# Altium schematic sheet MGC3130.SchDoc
size A
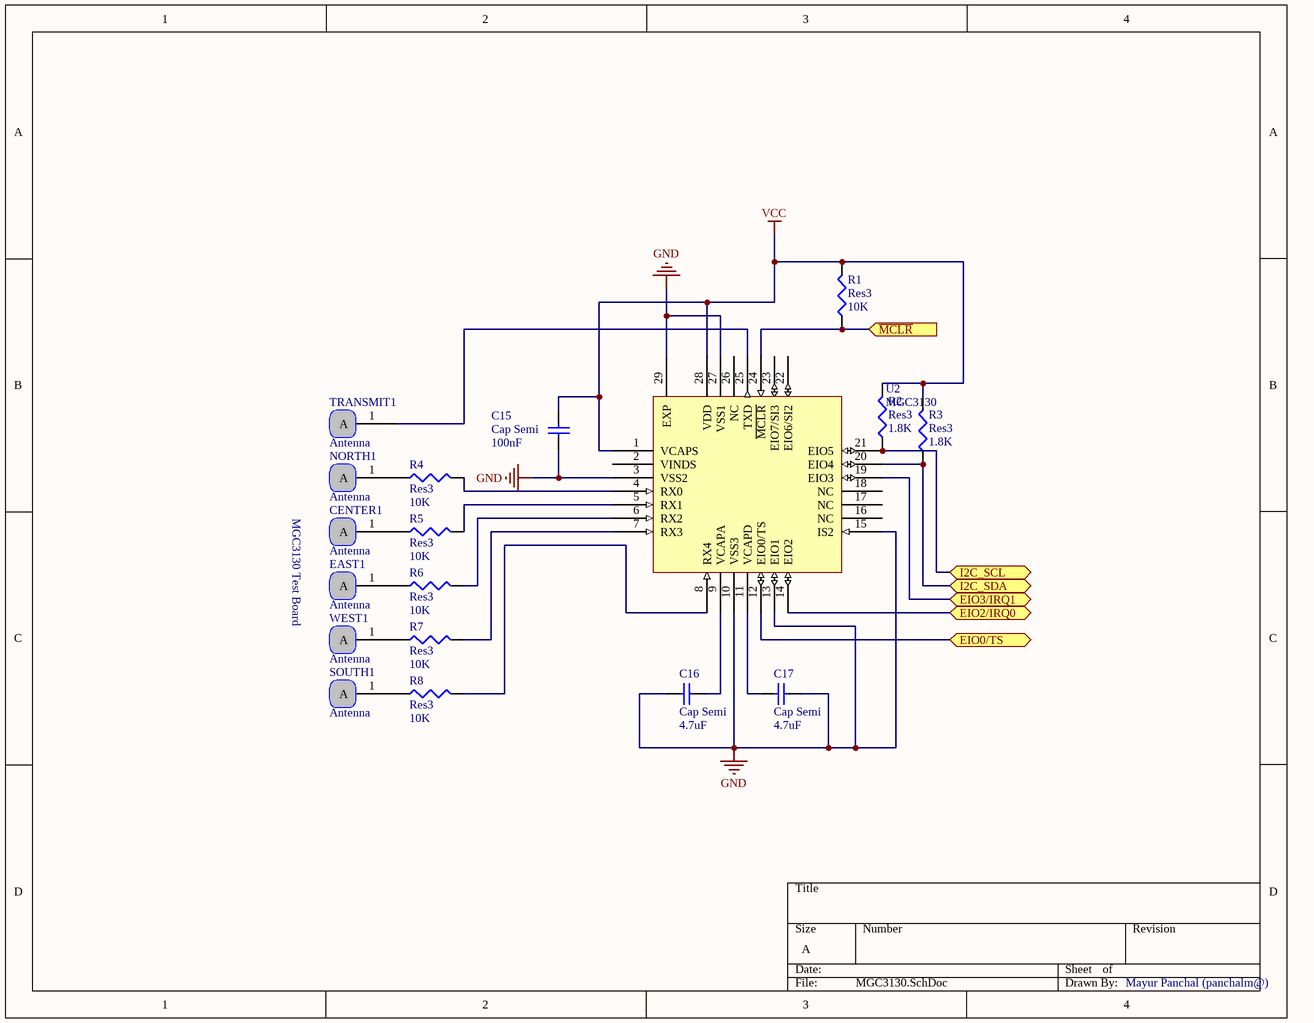
[diagram p0: MGC3130.SchDoc]

## Parts
C15  Cap Semi  value 100nF  [1608[0603]]
C16  Cap Semi  value 4.7uF  [1608[0603]]
C17  Cap Semi  value 4.7uF  [1608[0603]]
CENTER1  Antenna
EAST1  Antenna  [Vertical Electrode]
NORTH1  Antenna  [Horizontal Electrode]
R1  Res3  value 10K  [J1-0603]
R2  Res3  value 1.8K  [J1-0603]
R3  Res3  value 1.8K  [J1-0603]
R4  Res3  value 10K  [J1-0603]
R5  Res3  value 10K  [J1-0603]
R6  Res3  value 10K  [J1-0603]
R7  Res3  value 10K  [J1-0603]
R8  Res3  value 10K  [J1-0603]
SOUTH1  Antenna  [Horizontal Electrode]
TRANSMIT1  Antenna
U2  MGC3130  [QFN28]
WEST1  Antenna  [Vertical Electrode]

## Ports
EIO0/TS (bidir), EIO2/IRQ0 (bidir), EIO3/IRQ1 (bidir), I2C_SCL (bidir), I2C_SDA (bidir), ~{MCLR} (in)

## Nets
GND: C15.1 C16.1 C17.2 U2.3(VSS2) U2.10(VSS3) U2.13(EIO1) U2.15(IS2) U2.27(VSS1) U2.29(EXP)
VCC: C15.2 R1.2 R2.2 R3.2 U2.1(VCAPS) U2.28(VDD)
~{MCLR}: R1.1 U2.24(~{MCLR}) ; port ~{MCLR}
EIO0/TS: U2.12(EIO0/TS) ; port EIO0/TS
EIO2/IRQ0: U2.14(EIO2) ; port EIO2/IRQ0
EIO3/IRQ1: U2.19(EIO3) ; port EIO3/IRQ1
I2C_SCL: R2.1 U2.21(EIO5) ; port I2C_SCL
I2C_SDA: R3.1 U2.20(EIO4) ; port I2C_SDA
NetC16_2: C16.2 U2.9(VCAPA)
NetC17_1: C17.1 U2.11(VCAPD)
NetCENTER1_1: CENTER1.1(A) R5.1
NetEAST1_1: EAST1.1(A) R6.1
NetNORTH1_1: NORTH1.1(A) R4.1
NetR4_2: R4.2 U2.4(RX0)
NetR5_2: R5.2 U2.5(RX1)
NetR6_2: R6.2 U2.6(RX2)
NetR7_1: R7.1 WEST1.1(A)
NetR7_2: R7.2 U2.7(RX3)
NetR8_1: R8.1 SOUTH1.1(A)
NetR8_2: R8.2 U2.8(RX4)
NetTRANSMIT1_1: TRANSMIT1.1(A) U2.25(TXD)

Not connected (* = marked no-connect by the designer): U2 2(VINDS) 16(NC) 17(NC) 18(NC) 22(EIO6/SI2) 23(EIO7/SI3) 26(NC)

## Notes on the sheet
- MGC3130 Test Board
- Mayur Panchal (panchalm@)

## Library data of the parts
C15-C17 = Cap Semi: Capacitor (Semiconductor SIM Model); Published: 8-Jun-2000; LatestRevisionDate: 29-May-2009; LatestRevisionNote: IPC-7351 Footprint Added.; PackageReference: C1206; Publisher: Altium Limited; PackageDescription: Chip Capacitor
CENTER1 = Center Antenna
EAST1 = East Antenna
NORTH1 = North Antenna
R1-R8 = Res3: Resistor; Published: 8-Jun-2000; LatestRevisionDate: 29-May-2009; LatestRevisionNote: IPC-7351 Footprint Added.; PackageReference: J1-0603; Publisher: Altium Limited; PackageDescription: Chip Resistor
SOUTH1 = South Antenna
TRANSMIT1 = Transmit Antenna
U2 = MGC3130: Gesture Recognition IC
WEST1 = West Antenna